# Altium project wulpus_acq_pcb.PrjPcb (part 2 of 2)

## Sheet 02_MSP430.SchDoc: Wearable Ultra Low-Power Ultrasound probe
size A3; DrawnBy: Sebastian Frey; Organization: Integrated Systems Laboratory; Revision: v1.2; SheetNumber: 3; SheetTotal: 6
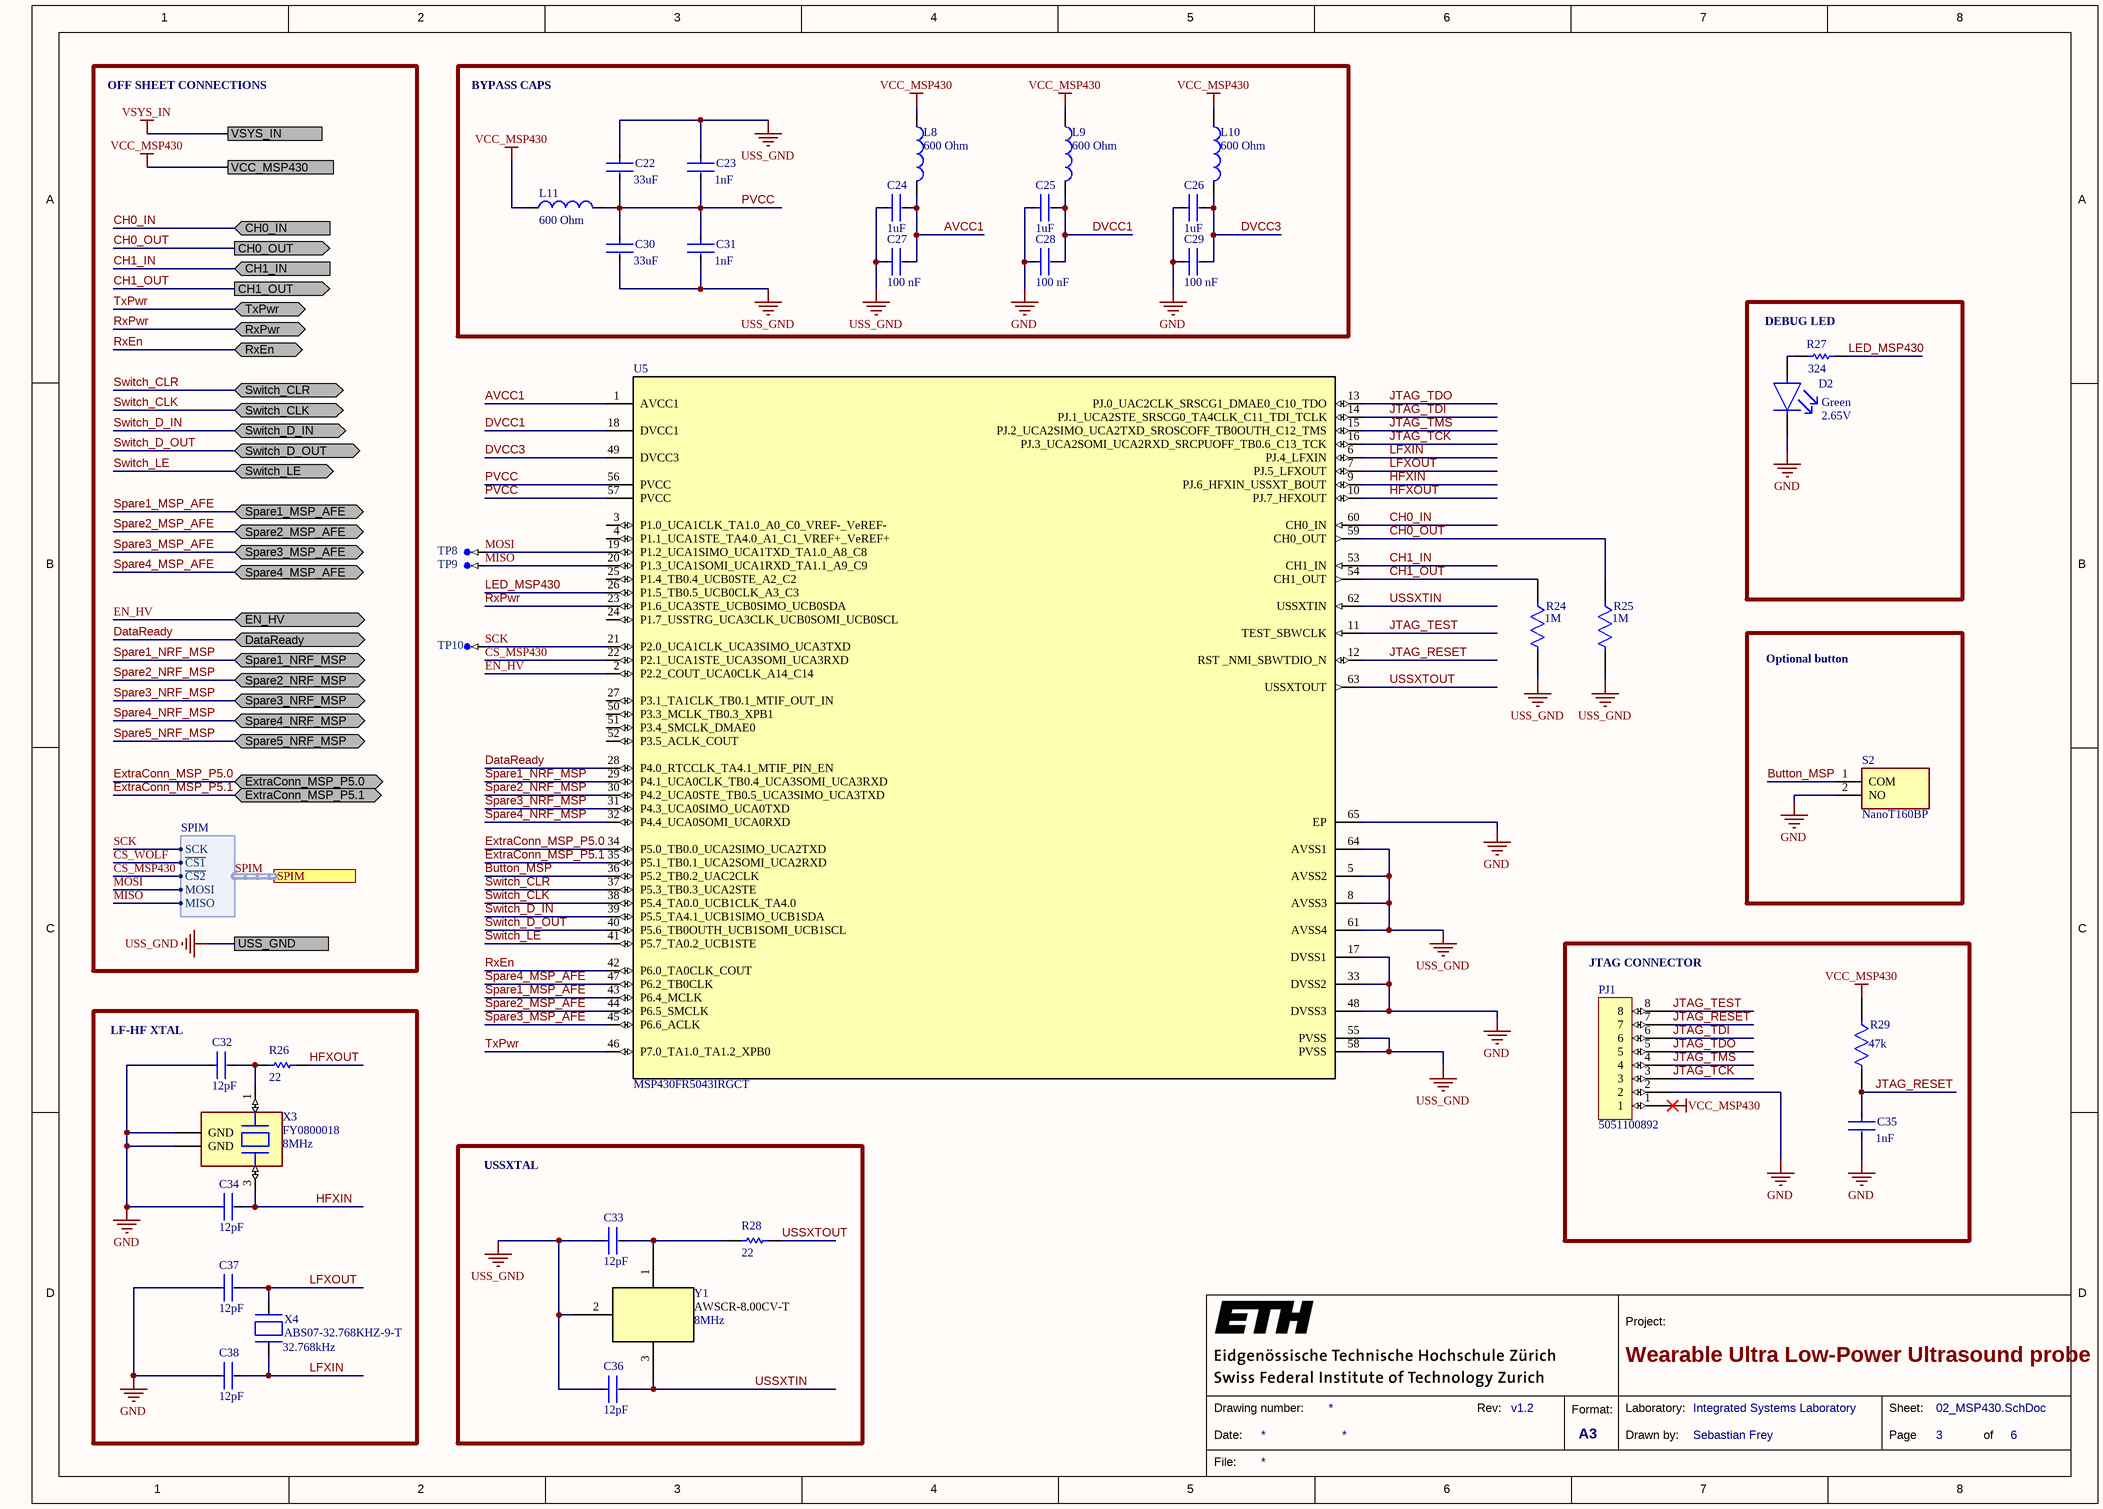
[diagram p2: 02_MSP430.SchDoc]

### Parts
C22  Capacitance: 33uF  [FP-C2012-125-0_2-IPC_A]  (hidden comment: C2012X5R1A336M125AC)
C23  Capacitance: 1nF  [FP-GRM155-0_05-IPC_B]  (hidden comment: GRM1555C1H102JA01D)
C24  Capacitance: 1uF  [FP-C1608-080-0_1-IPC_B]  (hidden comment: C1608X7R1C105K080AC)
C25  Capacitance: 1uF  [FP-C1608-080-0_1-IPC_B]  (hidden comment: C1608X7R1C105K080AC)
C26  Capacitance: 1uF  [FP-C1608-080-0_1-IPC_B]  (hidden comment: C1608X7R1C105K080AC)
C27  value 100 nF  [FP-CC0402-MFG]  (hidden comment: CC0402KRX7R7BB104)
C28  value 100 nF  [FP-CC0402-MFG]  (hidden comment: CC0402KRX7R7BB104)
C29  value 100 nF  [FP-CC0402-MFG]  (hidden comment: CC0402KRX7R7BB104)
C30  Capacitance: 33uF  [FP-C2012-125-0_2-IPC_A]  (hidden comment: C2012X5R1A336M125AC)
C31  Capacitance: 1nF  [FP-GRM155-0_05-IPC_B]  (hidden comment: GRM1555C1H102JA01D)
C32  Capacitance: 12pF  [FP-GJM155-0_05-IPC_A]  (hidden comment: GJM1555C1H120GB01D)
C33  Capacitance: 12pF  [FP-GJM155-0_05-IPC_A]  (hidden comment: GJM1555C1H120GB01D)
C34  Capacitance: 12pF  [FP-GJM155-0_05-IPC_A]  (hidden comment: GJM1555C1H120GB01D)
C35  Capacitance: 1nF  [FP-GRM155-0_05-IPC_B]  (hidden comment: GRM1555C1H102JA01D)
C36  Capacitance: 12pF  [FP-GJM155-0_05-IPC_A]  (hidden comment: GJM1555C1H120GB01D)
C37  Capacitance: 12pF  [FP-GJM155-0_05-IPC_A]  (hidden comment: GJM1555C1H120GB01D)
C38  Capacitance: 12pF  [FP-GJM155-0_05-IPC_A]  (hidden comment: GJM1555C1H120GB01D)
D2  Forward Voltage: 2.65V  Color: Green  [FP-APHD1608LZGCK-MFG]  (hidden comment: APHD1608LZGCK)
L8  Impedance: 600 Ohm  [SMD-0805]  (hidden comment: 742792040)
L9  Impedance: 600 Ohm  [SMD-0805]  (hidden comment: 742792040)
L10  Impedance: 600 Ohm  [SMD-0805]  (hidden comment: 742792040)
L11  Impedance: 600 Ohm  [SMD-0805]  (hidden comment: 742792040)
PJ1  5051100892  [MOLEX_5051100892]
R24  Resistance: 1M  [FP-CRCW0402-e3-MFG]  (hidden comment: CRCW04021M00FKED)
R25  Resistance: 1M  [FP-CRCW0402-e3-MFG]  (hidden comment: CRCW04021M00FKED)
R26  Resistance: 22  [RESC1005X40X25NL05T10]  (hidden comment: RC0402JR-0722RL)
R27  Resistance: 324  [RESC1005X35X20ML05T10]  (hidden comment: CPF0402B324RE1)
R28  Resistance: 22  [RESC1005X40X25NL05T10]  (hidden comment: RC0402JR-0722RL)
R29  Resistance: 47k  [FP-CRCW0402-e3-IPC_C]  (hidden comment: CRCW040247K0FKED)
S2  NanoT160BP  [NanoT160BP]
TP8  TP-SM-C-100  [TP-SM-C-100]  (value not drawn)  (no BOM)
TP9  TP-SM-C-100  [TP-SM-C-100]  (value not drawn)  (no BOM)
TP10  TP-SM-C-100  [TP-SM-C-100]  (value not drawn)  (no BOM)
U5  MSP430FR5043IRGCT  [RGC0064G]
X3  FY0800018  Frequency: 8MHz  [XTAL_ECS-80-18-30B-AGN-TR]
X4  ABS07-32.768KHZ-9-T  Frequency: 32.768kHz  [XTAL320X150X90]
Y1  Frequency: 8MHz  [AWSCR-8.00CV-T_ABR]  (hidden comment: AWSCR-8.00CV-T)

### Blocks framed on the sheet
BYPASS CAPS: C22-C31 L8-L11
DEBUG LED: D2 R27
Optional button: S2
JTAG CONNECTOR: C35 PJ1 R29
LF-HF XTAL: C32 C34 C37 C38 R26 X3 X4
USSXTAL: C33 C36 R28 Y1

### Ports
CH0_IN (in), CH0_OUT (out), CH1_IN (in), CH1_OUT (out), DataReady (bidir), EN_HV (bidir), ExtraConn_MSP_P5.0 (bidir), ExtraConn_MSP_P5.1 (bidir), RxEn (bidir), RxPwr (bidir), Spare1_MSP_AFE (bidir), Spare1_NRF_MSP (bidir), Spare2_MSP_AFE (bidir), Spare2_NRF_MSP (bidir), Spare3_MSP_AFE (bidir), Spare3_NRF_MSP (bidir), Spare4_MSP_AFE (bidir), Spare4_NRF_MSP (bidir), Spare5_NRF_MSP (bidir), SPIM (harness SPIM), Switch_CLK (bidir), Switch_CLR (bidir), Switch_D_IN (bidir), Switch_D_OUT (bidir), Switch_LE (bidir), TxPwr (bidir), USS_GND, VCC_MSP430, VSYS_IN

### Harnesses
SPIM: SCK, ~{CS1}, ~{CS2}, MOSI, MISO

### Nets
GND: C25.2 C26.2 C28.1 C29.1 C32.1 C34.1 C35.2 C37.1 C38.1 D2.1(C) PJ1.2 S2.2(NO) U5.17(DVSS1) U5.33(DVSS2) U5.48(DVSS3) U5.65(EP) X3.2(GND) X3.4(GND)
USS_GND: C22.1 C23.1 C24.2 C27.1 C30.2 C31.2 C33.1 C36.1 R24.2 R25.2 U5.5(AVSS2) U5.8(AVSS3) U5.55(PVSS) U5.58(PVSS) U5.61(AVSS4) U5.64(AVSS1) Y1.2 ; port USS_GND
VCC_MSP430: L8.1 L9.1 L10.1 L11.1 PJ1.1 R29.1 ; port VCC_MSP430
AVCC1: C24.1 C27.2 L8.2 U5.1(AVCC1)
Button_MSP: S2.1(COM) U5.36(P5.2_TB0.2_UAC2CLK)
CH0_IN: U5.60(CH0_IN) ; port CH0_IN
CH0_OUT: R25.1 U5.59(CH0_OUT) ; port CH0_OUT
CH1_IN: U5.53(CH1_IN) ; port CH1_IN
CH1_OUT: R24.1 U5.54(CH1_OUT) ; port CH1_OUT
CS_MSP430: U5.22(P2.1_UCA1STE_UCA3SOMI_UCA3RXD) ; port SPIM.~{CS2}
DataReady: U5.28(P4.0_RTCCLK_TA4.1_MTIF_PIN_EN) ; port DataReady
DVCC1: C25.1 C28.2 L9.2 U5.18(DVCC1)
DVCC3: C26.1 C29.2 L10.2 U5.49(DVCC3)
EN_HV: U5.2(P2.2_COUT_UCA0CLK_A14_C14) ; port EN_HV
ExtraConn_MSP_P5.0: U5.34(P5.0_TB0.0_UCA2SIMO_UCA2TXD) ; port ExtraConn_MSP_P5.0
ExtraConn_MSP_P5.1: U5.35(P5.1_TB0.1_UCA2SOMI_UCA2RXD) ; port ExtraConn_MSP_P5.1
HFXIN: C34.2 U5.9(PJ.6_HFXIN_USSXT_BOUT) X3.3(OUT/IN)
HFXOUT: R26.2 U5.10(PJ.7_HFXOUT)
JTAG_RESET: C35.1 PJ1.7 R29.2 U5.12(RST__NMI_SBWTDIO_N)
JTAG_TCK: PJ1.3 U5.16(PJ.3_UCA2SOMI_UCA2RXD_SRCPUOFF_TB0.6_C13_TCK)
JTAG_TDI: PJ1.6 U5.14(PJ.1_UCA2STE_SRSCG0_TA4CLK_C11_TDI_TCLK)
JTAG_TDO: PJ1.5 U5.13(PJ.0_UAC2CLK_SRSCG1_DMAE0_C10_TDO)
JTAG_TEST: PJ1.8 U5.11(TEST_SBWCLK)
JTAG_TMS: PJ1.4 U5.15(PJ.2_UCA2SIMO_UCA2TXD_SROSCOFF_TB0OUTH_C12_TMS)
LED_MSP430: R27.1 U5.26(P1.5_TB0.5_UCB0CLK_A3_C3)
LFXIN: C38.2 U5.6(PJ.4_LFXIN) X4.1
LFXOUT: C37.2 U5.7(PJ.5_LFXOUT) X4.2
MISO: TP9.1 U5.20(P1.3_UCA1SOMI_UCA1RXD_TA1.1_A9_C9) ; port SPIM.MISO
MOSI: TP8.1 U5.19(P1.2_UCA1SIMO_UCA1TXD_TA1.0_A8_C8) ; port SPIM.MOSI
PVCC: C22.2 C23.2 C30.1 C31.1 L11.2 U5.56(PVCC) U5.57(PVCC)
RxEn: U5.42(P6.0_TA0CLK_COUT) ; port RxEn
RxPwr: U5.23(P1.6_UCA3STE_UCB0SIMO_UCB0SDA) ; port RxPwr
SCK: TP10.1 U5.21(P2.0_UCA1CLK_UCA3SIMO_UCA3TXD) ; port SPIM.SCK
Spare1_MSP_AFE: U5.43(P6.4_MCLK) ; port Spare1_MSP_AFE
Spare1_NRF_MSP: U5.29(P4.1_UCA0CLK_TB0.4_UCA3SOMI_UCA3RXD) ; port Spare1_NRF_MSP
Spare2_MSP_AFE: U5.44(P6.5_SMCLK) ; port Spare2_MSP_AFE
Spare2_NRF_MSP: U5.30(P4.2_UCA0STE_TB0.5_UCA3SIMO_UCA3TXD) ; port Spare2_NRF_MSP
Spare3_MSP_AFE: U5.45(P6.6_ACLK) ; port Spare3_MSP_AFE
Spare3_NRF_MSP: U5.31(P4.3_UCA0SIMO_UCA0TXD) ; port Spare3_NRF_MSP
Spare4_MSP_AFE: U5.47(P6.2_TB0CLK) ; port Spare4_MSP_AFE
Spare4_NRF_MSP: U5.32(P4.4_UCA0SOMI_UCA0RXD) ; port Spare4_NRF_MSP
Spare5_NRF_MSP: port Spare5_NRF_MSP
Switch_CLK: U5.38(P5.4_TA0.0_UCB1CLK_TA4.0) ; port Switch_CLK
Switch_CLR: U5.37(P5.3_TB0.3_UCA2STE) ; port Switch_CLR
Switch_D_IN: U5.39(P5.5_TA4.1_UCB1SIMO_UCB1SDA) ; port Switch_D_IN
Switch_D_OUT: U5.40(P5.6_TB0OUTH_UCB1SOMI_UCB1SCL) ; port Switch_D_OUT
Switch_LE: U5.41(P5.7_TA0.2_UCB1STE) ; port Switch_LE
TxPwr: U5.46(P7.0_TA1.0_TA1.2_XPB0) ; port TxPwr
USSXTIN: C36.2 U5.62(USSXTIN) Y1.3
USSXTOUT: R28.2 U5.63(USSXTOUT)
NetC32_2: C32.2 R26.1 X3.1(IN/OUT)
NetC33_2: C33.2 R28.1 Y1.1
NetD2_2: D2.2(A) R27.2

Not connected (* = marked no-connect by the designer): U5 3(P1.0_UCA1CLK_TA1.0_A0_C0_VREF-_VeREF-) 4(P1.1_UCA1STE_TA4.0_A1_C1_VREF+_VeREF+) 24(P1.7_USSTRG_UCA3CLK_UCB0SOMI_UCB0SCL) 25(P1.4_TB0.4_UCB0STE_A2_C2) 27(P3.1_TA1CLK_TB0.1_MTIF_OUT_IN) 50(P3.3_MCLK_TB0.3_XPB1) 51(P3.4_SMCLK_DMAE0) 52(P3.5_ACLK_COUT)

### Buses and harness runs
harness SPIM = port SPIM

### Notes on the sheet
- OFF SHEET CONNECTIONS
- 1
- 2
- 3
- 4
- 5
- 6
- 7
- 8
- A
- B
- C
- D
- Project:
- Date:
- Drawing number:
- Rev:
- Format:
- A3
- Drawn by:
- Laboratory:
- Page
- Sheet:
- of
- File:

### Library data of the parts
C22 C30 = CMP-08246-002720-1: Multilayer Ceramic Capacitors 33μF ±20% 10V X5R SMD 0805; Dielectric: X5R; Series: C; Packaging: Tape and Reel; Voltage Rating: 10V; Height: 1.25mm; Tolerance: 20%; Thickness: 0.057inch; Min Operating Temperature: -55°C; Max Operating Temperature: 85°C; Case Code (Imperial): 0805; Voltage Rating (DC): 10V; Case Code (Metric): 2012; Length: 2mm; REACH SVHC: No SVHC; Depth: 1.25mm; Package Quantity: 1; Dielectric Material: Ceramic; Lead Free: Lead Free; Case/Package: 0805; Termination: SMD/SMT; Resistor Type: Ceramic; RoHS Compliant: Yes; Width: 0.049inch; Weight: 0.000194oz; Mount: Surface Mount
C23 C31 C35 = CMP-2008-04254-2: Chip Multilayer Ceramic Capacitors for General Purpose, 0402, 1000pF, C0G, 30ppm/°C, 5%, 50V; Insulation Resistance: 10GR; Packaging: Tape and Reel; Lead Free: Lead Free; Tolerance: 5%; Temperature Coefficient: 30ppm/°C; Thickness: 0.022inch; Termination: SMD/SMT; Max Operating Temperature: 125°C; Height: 0.5mm; Package Quantity: 1; Radiation Hardening: No; Material: Ceramic; Case Code (Metric): 1005; Number of Pins: 2; Voltage Rating: 50V; Mount: Surface Mount; Voltage: 50V; Case/Package: 0402; Min Operating Temperature: -55°C; Dielectric Material: Ceramic; Width: 0.5mm; Depth: 0.5mm; Case Code (Imperial): 0402; REACH SVHC: No SVHC; Dielectric: C0G; Voltage Rating (DC): 50V; Length: 1mm
C24-C26 = CMP-08246-002727-1: Multilayer Ceramic Capacitors 1μF ±10% 16V X7R SMD 0603; Mount: Surface Mount; Width: 0.031inch; Radiation Hardening: No; Dielectric Material: Ceramic; Packaging: Tape and Reel; Voltage Rating: 16V; Weight: 7.1E-05oz; Termination: SMD/SMT; Package Quantity: 1; Voltage Rating (DC): 16V; REACH SVHC: No SVHC; Voltage: 16V; Min Operating Temperature: -55°C; Depth: 0.8mm; Height: 0.8mm; Length: 1.6mm; Case Code (Metric): 1608; Thickness: 0.037inch; Lead Free: Lead Free; Resistor Type: Ceramic; RoHS Compliant: Yes; Series: C; Construction: Flat; Max Operating Temperature: 125°C; Tolerance: 10%; Case/Package: 0603; Dielectric: X7R; Case Code (Imperial): 0603
C27-C29 = CMP-03422-000048-1: CAP CER 0.1UF 16V X7R 0402; Manufacturer: YAGEO; Material: Ceramic; Automotive Grade: NA; Temperature Coefficient: 30ppm/°C; Tolerance: 0.1; Device Class L1: Passive Components; Temperature Range Low: -55°C; Device Class L3: Ceramic Capacitors; Temperature Characteristic: X7R; Ipc Land Pattern Name: CAPC10050X50; Capacitance: 100 nF; Temperature Range High: +125°C; Voltage Rating: 16 V; Temperature: -55°C to +125°C; RoHS: TRUE; Automotive: No; Height: 0.55mm; Device Class L2: Capacitors; Digikey Description: CAP CER 0.1UF 16V X7R 0402; Package: CC0402; Footprint Url: http://www.yageo.com/exep/pages/download/literatures/UPY-C_GEN_24.pdf; ComponentLink2Description: Datasheet; Category: Cap; Lead Free: Yes; Octopart: https://octopart.com/cc0402krx7r7bb104-yageo-42244624; ComponentLink2URL: http://www.yageo.com/documents/recent/UPY-GP_NP0_16V-to-50V_16.pdf; Manufacturer Part Number: CC0402KRX7R7BB104; Mouser Description: 0402 0.1 uF 16 V ±10 % Tolerance X7R SMT Multilayer Ceramic Capacitor
C32-C34 C36-C38 = CMP-2008-03799-2: Multi-Layer Ceramic Capacitor 12pF C0G  ±2% 0402 Paper T/R; Voltage Rating: 50V; Tolerance: 2%; Length: 1mm; Width: 0.5mm; Thickness: 0.022inch; Package Quantity: 10000; Lead Free: Lead Free; Mount: Surface Mount; Voltage Rating (DC): 50V; Max Operating Temperature: 125°C; Termination: SMD/SMT; Depth: 0.5mm; Min Operating Temperature: -55°C; Height: 0.5mm; Case Code (Imperial): 0402; Case/Package: 0402; Case Code (Metric): 1005; Dielectric: C0G; Packaging: Tape and Reel; Radiation Hardening: No
D2 = CMP-44529-000045-1: LED GREEN CLEAR 1608 SMD; Test Current: 2mA; Dominant Wavelength: 525nm; Lens Color: Colorless; Luminous Intensity: 180mcd; Viewing Angle: 100°; Lens Size: 0.7mm; Lens Style: Round; Mount: Surface Mount; Packaging: Tape and Reel; Lens Transparency: Clear; Height: 0.75mm; Case/Package: 0603; Length: 1.6mm; Case Code (Metric): 1608; Width: 0.8mm; Case Code (Imperial): 0603
L8-L11 = CMP-0220-00032-1: SMD EMI Suppression Ferrite Bead WE-CBF, Z = 600 Ohm; PackageVersion: 2005; ComponentLink2Description: Datasheet; PackageDescription: Chip Inductor, 2-Leads, Body 2.0 x 1.2 mm; ComponentLink1URL: http://www.we-online.com; PackageReference: SMD-0805; DatasheetVersion: Dec-2005; ComponentLink2URL: http://www.we-online.de/katalog/media/pdf/742792040.pdf; ComponentLink1Description: Manufacturer Link
PJ1 = MOLEX_5051100892
R24 R25 = CMP-2002-08314-2: RES Thick Film, 1MΩ, 1%, 0.063W, 100ppm/°C, 0402; Power Rating: 63mW; Voltage Rating (DC): 50V; Min Operating Temperature: -55°C; Lead Free: Lead Free; Case Code (Imperial): 0402; Packaging: Tape and Reel; Case Code (Metric): 1005; Tolerance: 1%; Number of Terminations: 2; Features: Automotive AEC-Q200; Number of Pins: 2; Max Power Dissipation: 63mW; Height: 0.35mm; Weight: 2.3E-05oz; Package Quantity: 10; Contact Plating: Tin; Temperature Coefficient: 100ppm/°C; Radiation Hardening: No; Length: 1mm; Termination: SMD/SMT; Depth: 0.5mm; Case/Package: 0402; Voltage Rating: 50V; Composition: Thick Film; Width: 0.02inch; Max Operating Temperature: 155°C; Military Standard: Not
R26 R28 = CMP-2002-07961-1: Manufacturer: Yageo / Phycomp; Part Number: RC0402JR-0722RL
R27 = CMP-2002-03257-1: Manufacturer: TE Connectivity / AMP; Part Number: CPF0402B324RE1
R29 = CMP-02407-007705-1: RES Thick Film, 47kΩ, 1%, 0.063W, 100ppm/°C, 0402; Voltage Rating (DC): 50V; Power Rating: 63mW; Temperature Coefficient: 100ppm/°C; Mount: Surface Mount; Radiation Hardening: No; Case Code (Imperial): 0402; Case Code (Metric): 1005; Contact Plating: Tin; Case/Package: 0402; Package Quantity: 10000; Width: 0.5mm; Lead Free: Lead Free; Packaging: Tape and Reel; Length: 1mm; Max Operating Temperature: 155°C; Min Operating Temperature: -55°C; Tolerance: 1%; Weight: 2.3E-05oz; Working Voltage: 50V; Voltage Rating: 50V; Height: 0.35mm; Depth: 0.5mm; Composition: Thick Film; Number of Terminations: 2; Termination: SMD/SMT; Military Standard: Not
S2 = NanoT160BP: Switch; Manufacturer_Name: LITTELFUSE; Datasheet Link: https://www.ckswitches.com/media/2866/nanot.pdf; Height: 1mm; Manufacturer_Part_Number: NanoT160BP
TP8-TP10 = CMP-0484-00002-1: Test Point, Surface Mount, Circular, Pad Diameter 1 mm
U5 = MSP430FR5043IRGCT: No Description Available; Mfr_Name: Texas Instruments; Type: DEV; RefDes: RefDes; Copyright: Copyright (C) 2021 Ultra Librarian. All rights reserved.; Manufacturer_Part_Number: MSP430FR5043IRGCT
X3 = FY0800018: Crystal 8MHz ±30ppm (Tol) ±30ppm (Stability) 18pF FUND 100Ohm 4-Pin SMD T/R; Manufacturer: Diodes; ESR (Equivalent Series Resistance): 100R; Supplier 1: Digi-Key; Manufacturer Part Number: FY0800018; RoHS: Yes; Category: Crystals; Stock 1: 10869; Pricing 1: 1=0.80000, 10=0.70800, 50=0.66220, 100=0.58520, 500=0.55440 (USD); Mount: Surface Mount; Case/Package: SMD/SMT; Min Operating Temperature: -40°C; Max Operating Temperature: 85°C; Packaging: Cut Tape; Frequency Stability: 30ppm; Frequency Tolerance: 30ppm; Load Capacitance: 18pF; Length: 0.197inch; Width: 0.126inch; Height: 0.043inch; ComponentLink1URL: http://media.digikey.com/pdf/Data%20Sheets/Pericom%20PDFs/FY0800018_VerB.pdf?src-supplier=Digi-Key; ComponentLink1Description: http://media.digikey.com/pdf/Data%20Sheets/Pericom%20PDFs/FY0800018_VerB.pdf?src-supplier=Digi-Key; Supplier Part Number 1: FY0800018CT-ND
X4 = ABS07-32.768KHZ-9-T: Crystal; Miniature; 3.2 x 1.5 x 0.9mm; 32.768KHZ; 9pf; 20ppm -40+85C; SMD; T/R; Manufacturer: Abracon; ESR (Equivalent Series Resistance): 70kR; Insulation Resistance: 500MR; Supplier 1: Digi-Key; Manufacturer Part Number: ABS07-32.768KHZ-9-T; RoHS: Yes; Category: Crystals; Stock 1: 83876; Pricing 1: 1=1.36000, 10=1.30000, 50=1.27000, 100=1.08860, 500=1.05840, 1000=0.89208 (USD); Mount: Surface Mount; Case/Package: CSMD; Number of Pins: 2; Min Operating Temperature: -40°C; Max Operating Temperature: 85°C; Load Capacitance: 9pF; Packaging: Tape and Reel; Frequency Tolerance: 20ppm; Package Quantity: 3000; Tolerance: 20ppm; Frequency Stability: 20ppm; Termination: SMD/SMT; Series Resistance: 70kR; Series: ABS07; Operating Frequency: 32.768 kHz; Length: 3.2mm; Width: 1.5mm; Height: 0.035inch; Depth: 1.5mm; Radiation Hardening: No; RoHS Compliant: Yes; REACH SVHC: No SVHC; Lead Free: Lead Free; ComponentLink1URL: https://datasheet.ciiva.com/855/abs07-855948.pdf?src-supplier=Digi-Key; ComponentLink1Description: https://datasheet.ciiva.com/855/abs07-855948.pdf?src-supplier=Digi-Key; Supplier Part Number 1: 535-9544-1-ND
Y1 = AWSCR-8.00CV-T: No Description Available; Mfr_Name: Abracon; Copyright: Copyright (C) 2021 Ultra Librarian. All rights reserved.; RefDes: RefDes; Type: DEV; Manufacturer_Part_Number: AWSCR-8.00CV-T

## Sheet 03_MSP430_AFE.SchDoc: Wearable Ultra Low-Power Ultrasound probe
size A3; DrawnBy: Sebastian Frey; Organization: Integrated Systems Laboratory; Revision: v1.2; SheetNumber: 4; SheetTotal: 6
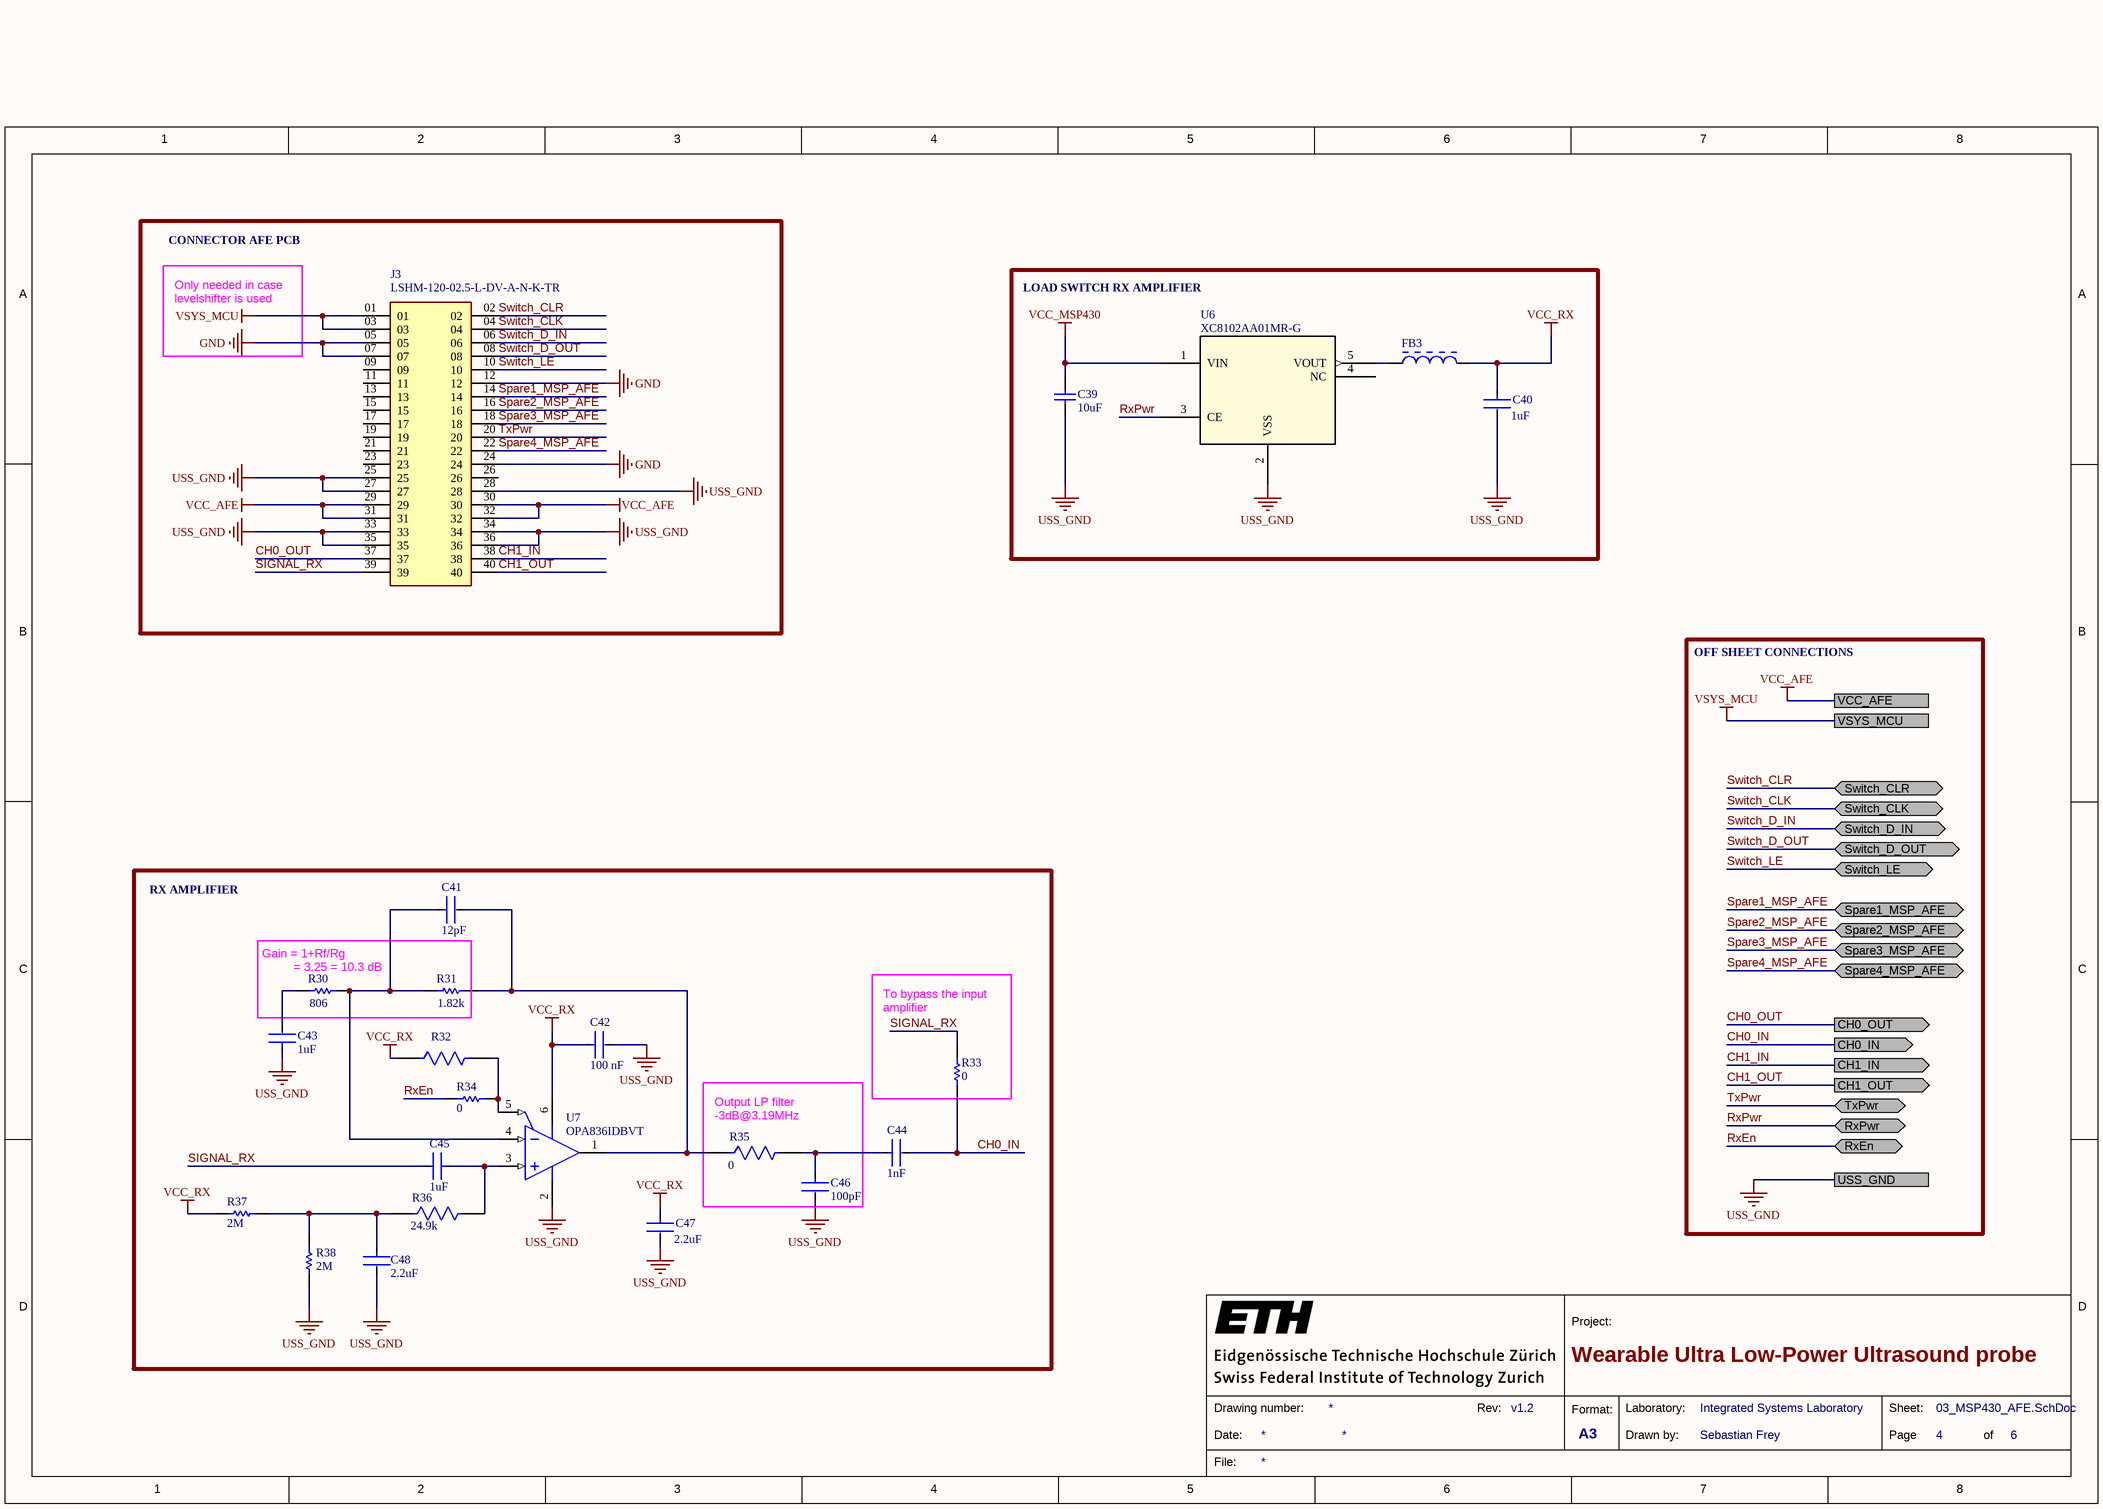
[diagram p3: 03_MSP430_AFE.SchDoc]

### Parts
C39  value 10uF  [CAPC0603(1608)100_L]  (hidden comment: C1608X5R1A106K080AC)
C40  Capacitance: 1uF  [FP-C1608-080-0_1-IPC_B]  (hidden comment: C1608X7R1C105K080AC)
C41  Capacitance: 12pF  [FP-GJM155-0_05-IPC_A]  (hidden comment: GJM1555C1H120GB01D)
C42  value 100 nF  [FP-CC0402-MFG]  (hidden comment: CC0402KRX7R7BB104)
C43  Capacitance: 1uF  [FP-C1608-080-0_1-IPC_B]  (hidden comment: C1608X7R1C105K080AC)
C44  Capacitance: 1nF  [FP-GRM155-0_05-IPC_B]  (hidden comment: GRM1555C1H102JA01D)
C45  Capacitance: 1uF  [FP-C1608-080-0_1-IPC_B]  (hidden comment: C1608X7R1C105K080AC)
C46  Capacitance: 100pF  [FP-04025A101JAT2A-MFG]  (hidden comment: 04025A101JAT2A)
C47  Capacitance: 2.2uF  [FP-CGA3E-0_3-0_1-MFG]  (hidden comment: GRM188R61C225KE15D)
C48  Capacitance: 2.2uF  [FP-CGA3E-0_3-0_1-MFG]  (hidden comment: GRM188R61C225KE15D)
FB3  BLM03AX800SN1D  [MURA-BLM03-CHIP-2_V]  (value not drawn)
J3  LSHM-120-02.5-L-DV-A-N-K-TR  [SAMTEC_LSHM-120-XX.X-X-DV-A-N-XX]
R30  Resistance: 806  [RESC1608X55X25LL10T15]  (hidden comment: RC0603FR-07806RL)
R31  Resistance: 1.82k  [RESC1608X55X25ML10T15]  (hidden comment: RC0603FR-071K82L)
R32  TNPW040210K0BEED  [FP-TNPW0402-e3-MFG]  (value not drawn)
R33  Resistance: 0  [RESC1005X40X25NL05T10]  (hidden comment: RC0402JR-070RL)
R34  Resistance: 0  [RESC1005X40X25NL05T10]  (hidden comment: RC0402JR-070RL)
R35  Resistance: 0  [FP-CR0402-IPC_B]  (hidden comment: CR0402-J/-000GLF)
R36  Resistance: 24.9k  [FP-RC_L0603-MFG]  (hidden comment: RC0603FR-0724K9L)
R37  Parameter 1: 2M  [RESC1608X55X30LL15T15]  (hidden comment: RC0603FR-072ML)
R38  Parameter 1: 2M  [RESC1608X55X30LL15T15]  (hidden comment: RC0603FR-072ML)
U6  XC8102AA01MR-G  [XC8102_SOT-25_TOR]
U7  OPA836IDBVT  [DBV0006A_L]

### Blocks framed on the sheet
CONNECTOR AFE PCB: J3
LOAD SWITCH RX AMPLIFIER: C39 C40 FB3 U6
RX AMPLIFIER: C41-C48 R30-R38 U7

### Ports
CH0_IN (out), CH0_OUT (out), CH1_IN (out), CH1_OUT (out), RxEn (bidir), RxPwr (bidir), Spare1_MSP_AFE (bidir), Spare2_MSP_AFE (bidir), Spare3_MSP_AFE (bidir), Spare4_MSP_AFE (bidir), Switch_CLK (bidir), Switch_CLR (bidir), Switch_D_IN (bidir), Switch_D_OUT (bidir), Switch_LE (bidir), TxPwr (bidir), USS_GND, VCC_AFE, VSYS_MCU

### Nets
GND: J3.05 J3.07 J3.12 J3.24
USS_GND: C39.1 C40.1 C42.2 C43.2 C46.1 C47.2 C48.2 J3.25 J3.27 J3.28 J3.33 J3.34 J3.35 J3.36 R38.1 U6.2(VSS) U7.2(VS-) ; port USS_GND
VCC_AFE: J3.29 J3.30 J3.31 J3.32 ; port VCC_AFE
VCC_MSP430: C39.2 U6.1(VIN)
VCC_RX: C40.2 C42.1 C47.1 FB3.2 R32.1 R37.2 U7.6(VS+)
VSYS_MCU: J3.01 J3.03 ; port VSYS_MCU
CH0_IN: C44.2 R33.1 ; port CH0_IN
CH0_OUT: J3.37 ; port CH0_OUT
CH1_IN: J3.38 ; port CH1_IN
CH1_OUT: J3.40 ; port CH1_OUT
RxEn: R34.2 ; port RxEn
RxPwr: U6.3(CE) ; port RxPwr
SIGNAL_RX: C45.1 J3.39 R33.2
Spare1_MSP_AFE: J3.14 ; port Spare1_MSP_AFE
Spare2_MSP_AFE: J3.16 ; port Spare2_MSP_AFE
Spare3_MSP_AFE: J3.18 ; port Spare3_MSP_AFE
Spare4_MSP_AFE: J3.22 ; port Spare4_MSP_AFE
Switch_CLK: J3.04 ; port Switch_CLK
Switch_CLR: J3.02 ; port Switch_CLR
Switch_D_IN: J3.06 ; port Switch_D_IN
Switch_D_OUT: J3.08 ; port Switch_D_OUT
Switch_LE: J3.10 ; port Switch_LE
TxPwr: J3.20 ; port TxPwr
NetC41_1: C41.1 R30.2 R31.1 U7.4(VIN-)
NetC41_2: C41.2 R31.2 R35.1 U7.1(VOUT)
NetC43_1: C43.1 R30.1
NetC44_1: C44.1 C46.2 R35.2
NetC45_2: C45.2 R36.2 U7.3(VIN+)
NetC48_1: C48.1 R36.1 R37.1 R38.2
NetFB3_1: FB3.1 U6.5(VOUT)
NetR32_2: R32.2 R34.1 U7.5(~{PD})

Not connected (* = marked no-connect by the designer): J3 09 11 13 15 17 19 21 23 26; U6 4(NC)

### Notes on the sheet
- Only needed in case levelshifter is used
- OFF SHEET CONNECTIONS
- (near R30) Gain = 1+Rf/Rg
  = 3.25 = 10.3 dB
- (near R33) To bypass the input amplifier
- (near R35) Output LP filter
  -3dB@3.19MHz
- 1
- 2
- 3
- 4
- 5
- 6
- 7
- 8
- A
- B
- C
- D
- Project:
- Date:
- Drawing number:
- Rev:
- Format:
- A3
- Drawn by:
- Laboratory:
- Page
- Sheet:
- of
- File:

### Library data of the parts
C39 = CMP-1035-02799-1: CAP 10uF 10V ±10% 0603 (1608 Metric) Thickness 1mm SMD; Tolerance: Â±10%; Case-Metric: 1608; Case-EIA: 0603; Max Thickness: 1 mm; Technology: SMT; Rated Voltage: 10 V
C40 C43 C45 = CMP-08246-002727-1: as C24 on sheet 02_MSP430; Mount: Surface Mount; Width: 0.031inch; Radiation Hardening: No; Dielectric Material: Ceramic; Packaging: Tape and Reel; Voltage Rating: 16V; Weight: 7.1E-05oz; Termination: SMD/SMT; Package Quantity: 1; Voltage Rating (DC): 16V; REACH SVHC: No SVHC; Voltage: 16V; Min Operating Temperature: -55°C; Depth: 0.8mm; Height: 0.8mm; Length: 1.6mm; Case Code (Metric): 1608; Thickness: 0.037inch; Lead Free: Lead Free; Resistor Type: Ceramic; RoHS Compliant: Yes; Series: C; Construction: Flat; Max Operating Temperature: 125°C; Tolerance: 10%; Case/Package: 0603; Dielectric: X7R; Case Code (Imperial): 0603
C41 = CMP-2008-03799-2: as C32 on sheet 02_MSP430; Tolerance: 2%; Length: 1mm; Width: 0.5mm; Thickness: 0.022inch; Package Quantity: 10000; Lead Free: Lead Free; Mount: Surface Mount; Voltage Rating (DC): 50V; Max Operating Temperature: 125°C; Termination: SMD/SMT; Depth: 0.5mm; Min Operating Temperature: -55°C; Height: 0.5mm; Case Code (Imperial): 0402; Case/Package: 0402; Case Code (Metric): 1005; Dielectric: C0G; Packaging: Tape and Reel; Radiation Hardening: No
C42 = CMP-03422-000048-1: as C27 on sheet 02_MSP430; Device Class L1: Passive Components; Temperature Range Low: -55°C; Device Class L3: Ceramic Capacitors; Temperature Characteristic: X7R; Ipc Land Pattern Name: CAPC10050X50; Capacitance: 100 nF; Temperature Range High: +125°C; Voltage Rating: 16 V; Temperature: -55°C to +125°C; RoHS: TRUE; Automotive: No; Height: 0.55mm; Device Class L2: Capacitors; Digikey Description: CAP CER 0.1UF 16V X7R 0402; Package: CC0402; Footprint Url: http://www.yageo.com/exep/pages/download/literatures/UPY-C_GEN_24.pdf; ComponentLink2Description: Datasheet; Category: Cap; Lead Free: Yes; Octopart: https://octopart.com/cc0402krx7r7bb104-yageo-42244624; ComponentLink2URL: http://www.yageo.com/documents/recent/UPY-GP_NP0_16V-to-50V_16.pdf; Manufacturer Part Number: CC0402KRX7R7BB104; Mouser Description: 0402 0.1 uF 16 V ±10 % Tolerance X7R SMT Multilayer Ceramic Capacitor
C44 = CMP-2008-04254-2: as C23 on sheet 02_MSP430; Packaging: Tape and Reel; Lead Free: Lead Free; Tolerance: 5%; Temperature Coefficient: 30ppm/°C; Thickness: 0.022inch; Termination: SMD/SMT; Max Operating Temperature: 125°C; Height: 0.5mm; Package Quantity: 1; Radiation Hardening: No; Material: Ceramic; Case Code (Metric): 1005; Number of Pins: 2; Voltage Rating: 50V; Mount: Surface Mount; Voltage: 50V; Case/Package: 0402; Min Operating Temperature: -55°C; Dielectric Material: Ceramic; Width: 0.5mm; Depth: 0.5mm; Case Code (Imperial): 0402; REACH SVHC: No SVHC; Dielectric: C0G; Voltage Rating (DC): 50V; Length: 1mm
C46 = CMP-2008-02568-2: CAP CER 100PF 50V C0G/NP0 0402; Tolerance: 5%; Insulation Resistance: 1GR; Dielectric: C0G; Dissipation Factor: 2.5%; Temperature Coefficient: 30ppm/°C; Depth: 0.5mm; Max Operating Temperature: 125°C; Voltage: 50V; Contact Plating: Tin; Width: 0.02inch; Radiation Hardening: No; Case/Package: 0402; Voltage Rating: 50V; Packaging: Tape and Reel; Termination: SMD/SMT; REACH SVHC: No SVHC; Case Code (Metric): 1005; Mount: Surface Mount; Package Quantity: 1; Height: 0.56mm; Construction: Flat; Case Code (Imperial): 0402; RoHS Compliant: Yes; Voltage Rating (DC): 50V; Thickness: 0.022inch; Series: -; Min Operating Temperature: -55°C; Lead Free: Lead Free; Length: 1mm
C47 C48 = CMP-08246-002299-1: Cap Ceramic 2.2uF 16V X5R 10% Pad SMD 0603 +85°C Automotive T/R; Max Operating Temperature: 85°C; Thickness: 0.035inch; Composition: Ceramic; Height: 0.8mm; Radiation Hardening: No; Tolerance: 10%; Package Quantity: 1; Case/Package: 0603; Case Code (Imperial): 0603; Termination: SMD/SMT; Depth: 0.8mm; Width: 0.031inch; Case Code (Metric): 1608; Dielectric: X5R; Voltage Rating (DC): 16V; Voltage Rating: 16V; Ratings: AEC-Q200; REACH SVHC: No SVHC; Mount: Surface Mount; Packaging: Tape and Reel; Min Operating Temperature: -55°C; Length: 1.6mm; Weight: 7.1E-05oz
FB3 = CMP-0686-00058-2: Chip Ferrite Bead for Power lines and Signal Lines, 80 Ohm, 500 mA, -55 to 125 degC, 0.6 x 0.3 x 0.33 mm SMD, Tape and Reel; Manufacturer: Murata; DC Resistance: 0.18 Ohm Max.; Rated Current: 500 mA; Impedance (at 100 MHz): 80 Ohm +/- 25%; Material: Steel; Impedance: 80R; Current Rating: 500mA; DC Resistance (DCR): 180mR; Test Frequency: 100MHz; Tolerance: 25%; Number of Lines: 1; PackageReference: BLM03-2; ComponentLink2URL: http://www.murata.com/products/catalog/pdf/c31e.pdf; ComponentLink2Description: Datasheet; ComponentLink1Description: Manufacturer URL; DatasheetVersion: 08/2013; ComponentLink1URL: http://www.murata.com/; ComponentLink3Description: Package Specification; ComponentLink3URL: http://www.murata.com/products/catalog/pdf/c31e.pdf; PackageDescription: 2-Pin Chip, Body 0.6 x 0.3 mm; Packing: Tape and Reel; Operating Temperature Range: -55 to 125 degC; Mounting Technology: Surface Mount; PartNumber: BLM03AX800SN1D; Supplier 1: Digi-Key; Supplier Part Number 1: 490-5621-1-ND; Manufacturer Part Number: BLM03AX800SN1D; RoHS: Yes; Category: Inductors; Stock 1: 13310; Pricing 1: 1=0.19000, 10=0.15200, 25=0.11840, 50=0.09820, 100=0.08470, 250=0.06776, 500=0.06098, 1000=0.05082, 5000=0.04743 (USD); Case/Package: 0201; Number of Pins: 2; Case Code (Metric): 0603; Case Code (Imperial): 0201; Min Operating Temperature: -55°C; Max Operating Temperature: 125°C; Package Quantity: 1; Packaging: Tape and Reel; Max DC Current: 500mA; Termination: SMD/SMT; Max Current Rating: 500mA; Number of Circuits: 1; Length: 0.6mm; Height: 0.3mm; Width: 0.3mm; REACH SVHC: No SVHC; ComponentLink4URL: https://datasheet.ciiva.com/1013/l0110s0100blm03ax-1013986.pdf?src-supplier=Digi-Key; ComponentLink4Description: https://datasheet.ciiva.com/1013/l0110s0100blm03ax-1013986.pdf?src-supplier=Digi-Key; ComponentLink5URL: https://datasheet.ciiva.com/41449/001172131-da-01-en-drossel-0201-80r-0-6x0-3mm-15000st-41449422.pdf?src-supplier=Conrad; ComponentLink5Description: https://datasheet.ciiva.com/41449/001172131-da-01-en-drossel-0201-80r-0-6x0-3mm-15000st-41449422.pdf?src-supplier=Conrad; ComponentLink6URL: https://datasheet.ciiva.com/1013/l0110e-1013987.pdf?src-supplier=Digi-Key; ComponentLink6Description: https://datasheet.ciiva.com/1013/l0110e-1013987.pdf?src-supplier=Digi-Key; ComponentLink7URL: https://datasheet.ciiva.com/1013/l0110e-1013988.pdf?src-supplier=Digi-Key; ComponentLink7Description: https://datasheet.ciiva.com/1013/l0110e-1013988.pdf?src-supplier=Digi-Key; ComponentLink8URL: https://datasheet.ciiva.com/46423/1851884-46423882.pdf?src-supplier=Element14; ComponentLink8Description: https://datasheet.ciiva.com/46423/1851884-46423882.pdf?src-supplier=Element14
J3 = LSHM-120-02.5-L-DV-A-N-K-TR: Conn Socket and Terminal Strip HDR/SKT 40 POS 0.5mm Solder ST SMD T/R; Manufacturer: Samtec; Number of Contacts: 40; Supplier 1: Digi-Key; RoHS: Yes; Category: Connectors; Stock 1: 3008; Pricing 1: 1=6.60000, 10=5.97000, 25=5.63960, 50=5.50200, 100=5.22690, 250=4.67672 (USD); Contact Plating: Gold; Contact Material: Bronze; Housing Color: Black; Housing Material: Polymer; Min Operating Temperature: -55°C; Max Operating Temperature: 125°C; Number of Rows: 2; Termination: Solder; Packaging: Tape and Reel; Orientation: Straight; Series: LSH; Length: 14.7mm; Pitch: 0.5mm; Depth: 4.98mm; Radiation Hardening: No; REACH SVHC: No SVHC; RoHS Compliant: Yes; ComponentLink1URL: http://www.farnell.com/datasheets/2372721.pdf?src-supplier=Farnell; ComponentLink1Description: http://www.farnell.com/datasheets/2372721.pdf?src-supplier=Farnell; ComponentLink2URL: http://www.farnell.com/datasheets/2000266.pdf?src-supplier=Farnell; ComponentLink2Description: http://www.farnell.com/datasheets/2000266.pdf?src-supplier=Farnell; ComponentLink3URL: http://components.arrow.com/part/dataview/0323_01943898?src-supplier=Arrow+Europe; ComponentLink3Description: http://components.arrow.com/part/dataview/0323_01943898?src-supplier=Arrow+Europe; ComponentLink4URL: http://components.arrow.com/part/dataview/48680868S8397842N1004?src-supplier=Arrow+Electronics; ComponentLink4Description: http://components.arrow.com/part/dataview/48680868S8397842N1004?src-supplier=Arrow+Electronics; ComponentLink5URL: http://www.farnell.com/datasheets/2000266.pdf?src-supplier=Element14; ComponentLink5Description: http://www.farnell.com/datasheets/2000266.pdf?src-supplier=Element14; ComponentLink6URL: http://suddendocs.samtec.com/prints/lshm-1xx-xx.x-xx-dv-a-x-x-tr-mkt.pdf?src-supplier=Digi-Key; ComponentLink6Description: http://suddendocs.samtec.com/prints/lshm-1xx-xx.x-xx-dv-a-x-x-tr-mkt.pdf?src-supplier=Digi-Key; ComponentLink7URL: ftp://ftp.samtec.com/webfiles/PDF/LSHM.PDF?src-supplier=Avnet; ComponentLink7Description: ftp://ftp.samtec.com/webfiles/PDF/LSHM.PDF?src-supplier=Avnet; ComponentLink8URL: ftp://ftp.samtec.com/webfiles/PDF/LSHM.PDF?src-supplier=Avnet+Europe; ComponentLink8Description: ftp://ftp.samtec.com/webfiles/PDF/LSHM.PDF?src-supplier=Avnet+Europe; ComponentLink9URL: http://www.farnell.com/datasheets/2372721.pdf?src-supplier=Newark; ComponentLink9Description: http://www.farnell.com/datasheets/2372721.pdf?src-supplier=Newark; Supplier Part Number 1: SAM13196CT-ND; Manufacturer Part Number: LSHM-120-02.5-L-DV-A-N-K-TR
R30 = CMP-2000-04142-1: Manufacturer: Yageo; Part Number: RC0603FR-07806RL
R31 = CMP-2000-03938-1: Manufacturer: Yageo; Part Number: RC0603FR-071K82L
R32 = CMP-2002-01683-2: RES 10K OHM 0.1% 1/10W 0402; Manufacturer: Vishay; Power Rating: 0.1W; Temperature Coefficient: 25ppm/°C; Automotive Grade: Grade 0; Voltage Rating: 50V; Resistance: 10kΩ; Automotive: Yes; Digikey Description: RES 10K OHM 0.1% 1/10W 0402; Device Class L2: Resistors; Manufacturer Part Number: TNPW040210K0BEED; Temperature: -55°C to +155°C; ComponentLink2Description: Datasheet; Ipc Land Pattern Name: RESC10050X35; Temperature Range High: +155°C; Composition: Thin Film; Tolerance: 0.1%; Device Class L3: Chip SMD Resistors; Package: TNPW0402-e3; Octopart: https://octopart.com/tnpw040210k0beed-vishay-41229038; Device Class L1: Passive Components; Series: TNPW; Value: 10k; Temperature Range Low: -55°C; Height: 0.4mm; Category: Res; Lead Free: Yes; RoHS: TRUE; ComponentLink2URL: http://www.vishay.com/docs/28758/tnpw_e3.pdf
R33 R34 = CMP-1011-00001-2: Manufacturer: Yageo / Phycomp; Part Number: RC0402JR-070RL
R35 = CMP-2002-05495-2: Thick Film Chip Resistors 0402 0Ω 0.0625W 5%; Voltage Rating (DC): 50V; Max Power Dissipation: 63mW; Temperature Coefficient: 500ppm/°C; Power Rating: 62.5mW; Depth: 0.5mm; Packaging: Tape and Reel; REACH SVHC: No SVHC; Max Operating Temperature: 125°C; Case Code (Metric): 1005; Case Code (Imperial): 0402; Case/Package: 0402; Number of Pins: 2; Thickness: 356um; Composition: Thick Film; Voltage Rating: 50V; Min Operating Temperature: -55°C; Tolerance: 5%; Radiation Hardening: No; Height: 0.35mm; Termination: SMD/SMT; Width: 0.5mm; Mount: Surface Mount; Package Quantity: 10000; Contact Plating: Tin; Length: 1mm
R36 = CMP-03412-013083-1: RES SMD 24.9K OHM 1% 1/10W 0603; Manufacturer: Yageo; Approved Alternate Part Number: 541-1.00HHCT-ND; Voltage Rating: 75V; Power Rating: 0.1W; Value: 24.9kΩ; Power: 100mW; Temperature Coefficient: 100ppm/°C; Footprint Url: https://www.yageo.com/upload/website/yageo_PYu-R_Mount_10_19050818_343.pdf; Automotive: No; Temperature Range Low: -55°C; Manufacturer Part Number: RC0603FR-0724K9L; Ipc Land Pattern Name: RESC16080X45; Digikey Description: RES SMD 24.9K OHM 1% 1/10W 0603; Voltage: 75V; Composition: Thick Film; Device Class L1: Passive Components; Device Class L2: Resistors; Device Class L3: Chip SMD Resistors; ComponentLink2URL: https://www.yageo.com/upload/media/product/productsearch/datasheet/rchip/PYu-RC_Group_51_RoHS_L_10.pdf; Series: RC_L; Octopart: https://octopart.com/rc0603fr-0724k9l-yageo-1189838; RoHS: TRUE; Category: Res; Height: 0.55mm; Tolerance: 1%; Temperature: -55°C to +155°C; Temperature Range High: +155°C; ComponentLink2Description: Datasheet; Package: RC_L0603; Lead Free: Yes; Mouser Description: Res Thick Film 1.6 x 0.8 mm 24.9K Ohm 1% 0.1W(1/10W) 100ppm/ C Molded SMD Paper T/R
R37 R38 = CMP-2000-00320-1: Manufacturer: YAEGO; Part Number: RC0603FR-072ML
U6 = XC8102AA01MR-G: No Description Available; Mfr_Name: Torex Semiconductor; Copyright: Copyright (C) 2021 Ultra Librarian. All rights reserved.; Manufacturer_Part_Number: XC8102AA01MR-G; RefDes: RefDes; Type: DEV
U7 = CMP-0018-00480-2: Very Low Power, Rail to Rail Out, Negative Rail In, VFB Operational Amplifier, 2.5 to 5.5 V, -40 to 125 degC, 6-pin SOT23 (DBV6), Green (RoHS & no Sb/Br); Manufacturer: Texas Instruments; Iq per channel(Max)(mA): 1; Settling Time (0.1%)(Typ)(ns): 30; Vs(Min)(V): 2.5; Vio(Max)(mV): 0.4; 3rd Harmonic(dBc): 105; BW @ Acl(MHz): 205; Vs(Max)(V): 5.5; 2nd Harmonic(dBc): 85; Sub Family: Audio Operational Amplifier, High Output Current Amplifier (>=50mA), High Speed Amplifier (>=50MHz), Low Noise Amp (<=10nV/rtHz), Low Offset Voltage Amplifier (<=500uV), Low Supply Voltage Amplifier (<=2.7V); Vn at Flatband(Typ)(nV/rtHz): 4.6; Iib(Max)(nA): 1000; Slew Rate(Typ)(V/us): 560; Io(Typ)(mA): 50; Number of Channels: 1; Eco-Plan: Green (RoHS & no Sb/Br); PartNumber: OPA836IDBVT; ComponentLink3URL: http://www.ti.com/litv/pdf/mpds026h; ComponentLink3Description: Package Specification; @ MHz: 1; ComponentLink1Description: Manufacturer URL; ComponentLink2URL: http://www.ti.com/general/docs/lit/getliterature.tsp?genericPartNumber=OPA836&fileType=pdf; Acl, min stable gain(V/V): 1; PackageVersion: 4073253-5/K, 03/2006; PackageDescription: 6-Pin Plastic Small Outline, Body 1.6 x 2.9 mm, Pitch 0.95 mm; ComponentLink1URL: http://www.ti.com/; ComponentLink2Description: Datasheet; PackageReference: DBV0006A; Code_JEDEC: MO-178; DatasheetVersion: SLOS712D; Mounting Technology: Surface Mount

## Sheet 04_MR_WOLF.SchDoc: Wearable Ultra Low-Power Ultrasound probe
size A3; DrawnBy: Sebastian Frey; Organization: Integrated Systems Laboratory; Revision: v1.0; SheetNumber: 5; SheetTotal: 6
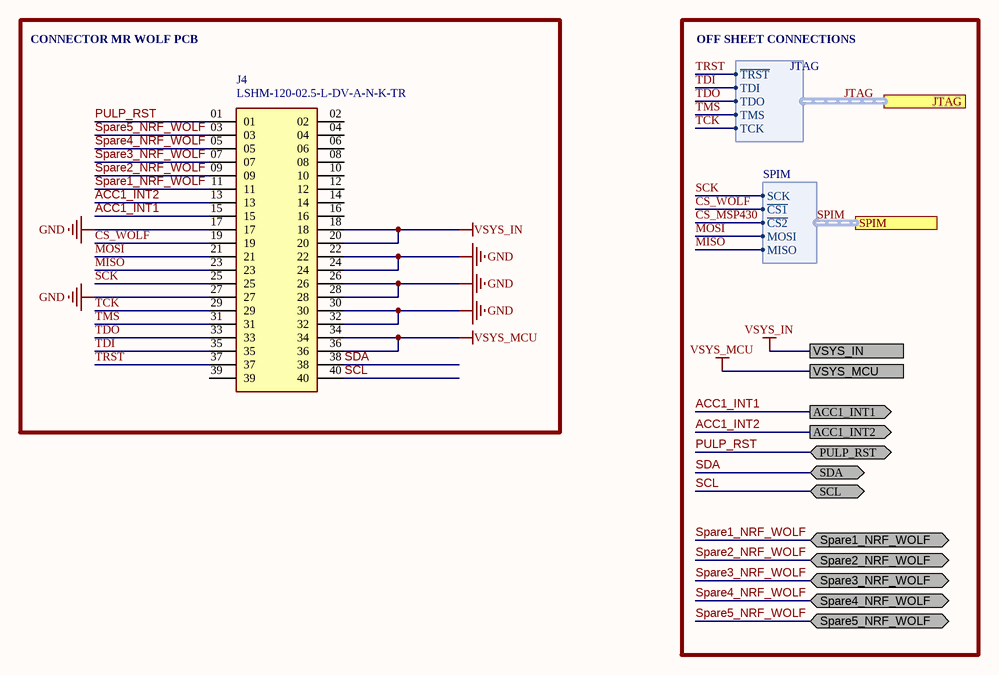
[diagram p4: 04_MR_WOLF.SchDoc]

### Parts
J4  LSHM-120-02.5-L-DV-A-N-K-TR  [SAMTEC_LSHM-120-XX.X-X-DV-A-N-XX]

### Blocks framed on the sheet
CONNECTOR MR WOLF PCB: J4

### Ports
ACC1_INT1 (out), ACC1_INT2 (out), JTAG (harness JTAG), PULP_RST (bidir), SCL (bidir), SDA (bidir), Spare1_NRF_WOLF (bidir), Spare2_NRF_WOLF (bidir), Spare3_NRF_WOLF (bidir), Spare4_NRF_WOLF (bidir), Spare5_NRF_WOLF (bidir), SPIM (harness SPIM), VSYS_IN, VSYS_MCU

### Harnesses
JTAG: ~{TRST}, TCK, TMS, TDI, TDO
SPIM: SCK, ~{CS1}, ~{CS2}, MOSI, MISO

### Nets
GND: J4.17 J4.22 J4.24 J4.26 J4.27 J4.28 J4.30 J4.32
VSYS_IN: J4.18 J4.20 ; port VSYS_IN
VSYS_MCU: J4.34 J4.36 ; port VSYS_MCU
ACC1_INT1: J4.15 ; port ACC1_INT1
ACC1_INT2: J4.13 ; port ACC1_INT2
CS_WOLF: J4.19 ; port SPIM.~{CS1}
MISO: J4.23 ; port SPIM.MISO
MOSI: J4.21 ; port SPIM.MOSI
PULP_RST: J4.01 ; port PULP_RST
SCK: J4.25 ; port SPIM.SCK
SCL: J4.40 ; port SCL
SDA: J4.38 ; port SDA
Spare1_NRF_WOLF: J4.11 ; port Spare1_NRF_WOLF
Spare2_NRF_WOLF: J4.09 ; port Spare2_NRF_WOLF
Spare3_NRF_WOLF: J4.07 ; port Spare3_NRF_WOLF
Spare4_NRF_WOLF: J4.05 ; port Spare4_NRF_WOLF
Spare5_NRF_WOLF: J4.03 ; port Spare5_NRF_WOLF
TCK: J4.29 ; port JTAG.TCK  [project net JTAG.TCK]
TDI: J4.35 ; port JTAG.TDI  [project net JTAG.TDI]
TDO: J4.33 ; port JTAG.TDO  [project net JTAG.TDO]
TMS: J4.31 ; port JTAG.TMS  [project net JTAG.TMS]
TRST: J4.37 ; port JTAG.~{TRST}  [project net JTAG.~{TRST}]

Not connected (* = marked no-connect by the designer): J4 02 04 06 08 10 12 14 16 39

### Buses and harness runs
harness JTAG = port JTAG
harness SPIM = port SPIM

### Notes on the sheet
- OFF SHEET CONNECTIONS
- 1
- 2
- 3
- 4
- 5
- 6
- 7
- 8
- A
- B
- C
- D
- Project:
- Date:
- Drawing number:
- Rev:
- Format:
- A3
- Drawn by:
- Laboratory:
- Page
- Sheet:
- of
- File:

### Library data of the parts
J4 = LSHM-120-02.5-L-DV-A-N-K-TR: as J3 on sheet 03_MSP430_AFE; Supplier 1: Digi-Key; RoHS: Yes; Category: Connectors; Stock 1: 3008; Pricing 1: 1=6.60000, 10=5.97000, 25=5.63960, 50=5.50200, 100=5.22690, 250=4.67672 (USD); Contact Plating: Gold; Contact Material: Bronze; Housing Color: Black; Housing Material: Polymer; Min Operating Temperature: -55°C; Max Operating Temperature: 125°C; Number of Rows: 2; Termination: Solder; Packaging: Tape and Reel; Orientation: Straight; Series: LSH; Length: 14.7mm; Pitch: 0.5mm; Depth: 4.98mm; Radiation Hardening: No; REACH SVHC: No SVHC; RoHS Compliant: Yes; ComponentLink1URL: http://www.farnell.com/datasheets/2372721.pdf?src-supplier=Farnell; ComponentLink1Description: http://www.farnell.com/datasheets/2372721.pdf?src-supplier=Farnell; ComponentLink2URL: http://www.farnell.com/datasheets/2000266.pdf?src-supplier=Farnell; ComponentLink2Description: http://www.farnell.com/datasheets/2000266.pdf?src-supplier=Farnell; ComponentLink3URL: http://components.arrow.com/part/dataview/0323_01943898?src-supplier=Arrow+Europe; ComponentLink3Description: http://components.arrow.com/part/dataview/0323_01943898?src-supplier=Arrow+Europe; ComponentLink4URL: http://components.arrow.com/part/dataview/48680868S8397842N1004?src-supplier=Arrow+Electronics; ComponentLink4Description: http://components.arrow.com/part/dataview/48680868S8397842N1004?src-supplier=Arrow+Electronics; ComponentLink5URL: http://www.farnell.com/datasheets/2000266.pdf?src-supplier=Element14; ComponentLink5Description: http://www.farnell.com/datasheets/2000266.pdf?src-supplier=Element14; ComponentLink6URL: http://suddendocs.samtec.com/prints/lshm-1xx-xx.x-xx-dv-a-x-x-tr-mkt.pdf?src-supplier=Digi-Key; ComponentLink6Description: http://suddendocs.samtec.com/prints/lshm-1xx-xx.x-xx-dv-a-x-x-tr-mkt.pdf?src-supplier=Digi-Key; ComponentLink7URL: ftp://ftp.samtec.com/webfiles/PDF/LSHM.PDF?src-supplier=Avnet; ComponentLink7Description: ftp://ftp.samtec.com/webfiles/PDF/LSHM.PDF?src-supplier=Avnet; ComponentLink8URL: ftp://ftp.samtec.com/webfiles/PDF/LSHM.PDF?src-supplier=Avnet+Europe; ComponentLink8Description: ftp://ftp.samtec.com/webfiles/PDF/LSHM.PDF?src-supplier=Avnet+Europe; ComponentLink9URL: http://www.farnell.com/datasheets/2372721.pdf?src-supplier=Newark; ComponentLink9Description: http://www.farnell.com/datasheets/2372721.pdf?src-supplier=Newark; Supplier Part Number 1: SAM13196CT-ND; Manufacturer Part Number: LSHM-120-02.5-L-DV-A-N-K-TR

## Sheet 05_IMU.SchDoc: Wearable Ultra Low-Power Ultrasound probe
size A3; DrawnBy: Sebastian Frey; Organization: Integrated Systems Laboratory; Revision: v1.0; SheetNumber: 6; SheetTotal: 6
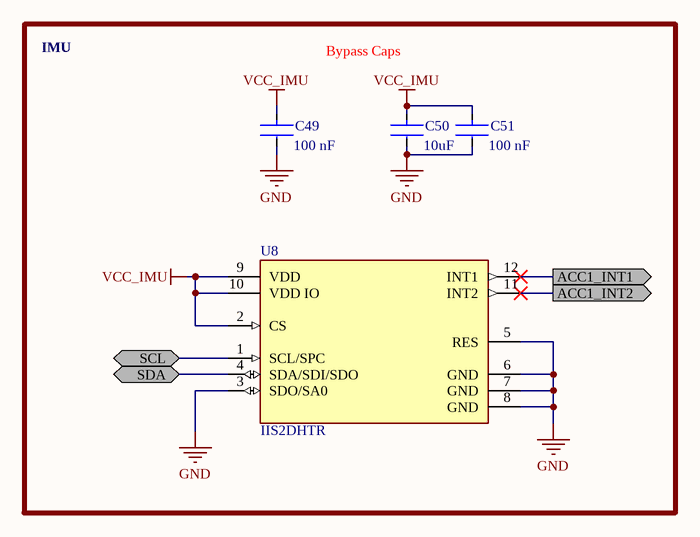
[diagram p5: 05_IMU.SchDoc]

### Parts
C49  value 100 nF  [FP-CC0402-MFG]  (hidden comment: CC0402KRX7R7BB104)
C50  value 10uF  [FP-C1608-080-MFG]  (hidden comment: C1608X5R1A106K080AC)
C51  value 100 nF  [FP-CC0402-MFG]  (hidden comment: CC0402KRX7R7BB104)
U8  IIS2DHTR  [FP-LGA-12-8365767-MFG]

### Blocks framed on the sheet
IMU: C49-C51 U8

### Ports
ACC1_INT1 (out), ACC1_INT2 (out), SCL (bidir), SDA (bidir)

### Nets
GND: C49.2 C50.2 C51.2 U8.3(SDO/SA0) U8.5(RES) U8.6(GND) U8.7(GND) U8.8(GND)
VCC_IMU: C49.1 C50.1 C51.1 U8.2(CS) U8.9(VDD) U8.10(VDD_IO)
ACC1_INT1: U8.12(INT1) ; port ACC1_INT1
ACC1_INT2: U8.11(INT2) ; port ACC1_INT2
SCL: U8.1(SCL/SPC) ; port SCL
SDA: U8.4(SDA/SDI/SDO) ; port SDA

### Notes on the sheet
- Bypass Caps
- 1
- 2
- 3
- 4
- 5
- 6
- 7
- 8
- A
- B
- C
- D
- Project:
- Date:
- Drawing number:
- Rev:
- Format:
- A3
- Drawn by:
- Laboratory:
- Page
- Sheet:
- of
- File:

### Library data of the parts
C49 C51 = CMP-03422-000048-1: as C27 on sheet 02_MSP430; Device Class L1: Passive Components; Temperature Range Low: -55°C; Device Class L3: Ceramic Capacitors; Temperature Characteristic: X7R; Ipc Land Pattern Name: CAPC10050X50; Capacitance: 100 nF; Temperature Range High: +125°C; Voltage Rating: 16 V; Temperature: -55°C to +125°C; RoHS: TRUE; Automotive: No; Height: 0.55mm; Device Class L2: Capacitors; Digikey Description: CAP CER 0.1UF 16V X7R 0402; Package: CC0402; Footprint Url: http://www.yageo.com/exep/pages/download/literatures/UPY-C_GEN_24.pdf; ComponentLink2Description: Datasheet; Category: Cap; Lead Free: Yes; Octopart: https://octopart.com/cc0402krx7r7bb104-yageo-42244624; ComponentLink2URL: http://www.yageo.com/documents/recent/UPY-GP_NP0_16V-to-50V_16.pdf; Manufacturer Part Number: CC0402KRX7R7BB104; Mouser Description: 0402 0.1 uF 16 V ±10 % Tolerance X7R SMT Multilayer Ceramic Capacitor
C50 = CMP-2000-04979-2: CAP CER 10UF 10V X5R 0603; Manufacturer: TDK; Temperature Coefficient: 15%; Tolerance: 10%; Material: Ceramic; Mouser Description: CAP CER 10UF 10V X5R 0603; Package: C1608-080; Lead Free: Yes; Device Class L1: Passive Components; Temperature Range High: +85°C; Manufacturer Part Number: C1608X5R1A106K080AC; Octopart: https://octopart.com/c1608x5r1a106k080ac-tdk-26013468; Voltage: 10V; Footprint Url: https://product.tdk.com/info/en/catalog/spec/mlccspec_commercial_general_midvoltage_en.pdf; Ipc Land Pattern Name: CAPC16080X80; Temperature Range Low: -55°C; Temperature: -55°C to +85°C; ComponentLink2Description: Datasheet; ComponentLink2URL: https://product.tdk.com/info/en/documents/chara_sheet/C1608X5R1A106K080AC.pdf; Height: 0.9mm; Temperature Characteristic: X5R; RoHS: TRUE; Category: Cap; Capacitance: 10uF; Digikey Description: CAP CER 10UF 10V X5R 0603; Automotive: No; Device Class L3: Ceramic Capacitors; Device Class L2: Capacitors; Voltage Rating: 10V
U8 = CMP-12175-000008-1: ACCEL 2-16G I2C/SPI 12LGA; Manufacturer: STMicroelectronics; Operating Supply Current: 2-11uA; Max Supply Voltage: 3.7V; Accel Axis: X+Y and Z; Sensor Output: I2C,SPI; Min Supply Voltage: 1.71V; Accel Range: 2/4/8/16g; Height: 1mm; Device Class L1: Sensors; Manufacturer Part Number: IIS2DHTR; Temperature Range High: +85°C; ComponentLink2Description: Datasheet; Automotive: No; Temperature Range Low: -40°C; Package: LGA-12-8365767; Octopart: https://octopart.com/iis2dhtr-stmicroelectronics-58218805; Digikey Description: ACCEL 2-16G I2C/SPI 12LGA; ComponentLink2URL: https://www.st.com/content/ccc/resource/technical/document/datasheet/group1/35/6d/04/26/27/5c/4d/7c/DM00171283/files/DM00171283.pdf/jcr:content/translations/en.DM00171283.pdf; Temperature: -40°C to +85°C; Category: IC; RoHS: TRUE; Device Class L3: Accelerometers; Lead Free: Yes; Device Class L2: Motion Sensors

## Nets that join several sheets
GND: 00_POWER (19 pins), 01_NRF52 (24 pins), 02_MSP430 (18 pins), 03_MSP430_AFE (J3.05 J3.07 J3.12 J3.24), 04_MR_WOLF (8 pins), 05_IMU (8 pins)
USS_GND: 00_POWER (8 pins), 02_MSP430 (17 pins), 03_MSP430_AFE (17 pins)
VCC_AFE: 00_POWER (R8.2 TP14.1), 01_NRF52 (J5.6), 03_MSP430_AFE (J3.29 J3.30 J3.31 J3.32)
VCC_IMU: 00_POWER (R13.2 TP22.1), 05_IMU (6 pins)
VCC_MSP430: 00_POWER (R11.2 TP20.1), 02_MSP430 (6 pins), 03_MSP430_AFE (C39.2 U6.1)
VCC_NRF52: 00_POWER (R10.2 TP18.1), 01_NRF52 (7 pins)
VSYS_IN: 00_POWER (5 pins), 04_MR_WOLF (J4.18 J4.20)
VSYS_MCU: 00_POWER (10 pins), 03_MSP430_AFE (J3.01 J3.03), 04_MR_WOLF (J4.34 J4.36)
ACC1_INT1: 01_NRF52 (U4.15), 04_MR_WOLF (J4.15), 05_IMU (U8.12)
ACC1_INT2: 01_NRF52 (U4.16), 04_MR_WOLF (J4.13), 05_IMU (U8.11)
CH0_IN: 02_MSP430 (U5.60), 03_MSP430_AFE (C44.2 R33.1)
CH0_OUT: 02_MSP430 (R25.1 U5.59), 03_MSP430_AFE (J3.37)
CH1_IN: 02_MSP430 (U5.53), 03_MSP430_AFE (J3.38)
CH1_OUT: 02_MSP430 (R24.1 U5.54), 03_MSP430_AFE (J3.40)
CS_MSP430: 01_NRF52 (U4.9), 02_MSP430 (U5.22)
CS_WOLF: 01_NRF52 (U4.14), 04_MR_WOLF (J4.19)
DataReady: 01_NRF52 (U4.41), 02_MSP430 (U5.28)
EN_HV: 00_POWER (R2.1 U1.5), 02_MSP430 (U5.2)
ExtraConn_MSP_P5.0: 01_NRF52 (J5.3), 02_MSP430 (U5.34)
ExtraConn_MSP_P5.1: 01_NRF52 (J5.4), 02_MSP430 (U5.35)
JTAG.~{TRST}: 01_NRF52 (U4.4), 04_MR_WOLF (J4.37)
JTAG.TCK: 01_NRF52 (U4.8), 04_MR_WOLF (J4.29)
JTAG.TDI: 01_NRF52 (U4.5), 04_MR_WOLF (J4.35)
JTAG.TDO: 01_NRF52 (U4.6), 04_MR_WOLF (J4.33)
JTAG.TMS: 01_NRF52 (U4.7), 04_MR_WOLF (J4.31)
MISO: 01_NRF52 (U4.11), 02_MSP430 (TP9.1 U5.20), 04_MR_WOLF (J4.23)
MOSI: 01_NRF52 (U4.12), 02_MSP430 (TP8.1 U5.19), 04_MR_WOLF (J4.21)
PULP_RST: 01_NRF52 (R21.1 U4.22), 04_MR_WOLF (J4.01)
RxEn: 02_MSP430 (U5.42), 03_MSP430_AFE (R34.2)
RxPwr: 02_MSP430 (U5.23), 03_MSP430_AFE (U6.3)
SCK: 01_NRF52 (U4.10), 02_MSP430 (TP10.1 U5.21), 04_MR_WOLF (J4.25)
SCL: 00_POWER (R20.2 U3.2), 01_NRF52 (U4.43), 04_MR_WOLF (J4.40), 05_IMU (U8.1)
SDA: 00_POWER (R19.2 U3.1), 01_NRF52 (U4.42), 04_MR_WOLF (J4.38), 05_IMU (U8.4)
Spare1_MSP_AFE: 02_MSP430 (U5.43), 03_MSP430_AFE (J3.14)
Spare1_NRF_MSP: 01_NRF52 (U4.40), 02_MSP430 (U5.29)
Spare1_NRF_WOLF: 01_NRF52 (U4.17), 04_MR_WOLF (J4.11)
Spare2_MSP_AFE: 02_MSP430 (U5.44), 03_MSP430_AFE (J3.16)
Spare2_NRF_MSP: 01_NRF52 (U4.39), 02_MSP430 (U5.30)
Spare2_NRF_WOLF: 01_NRF52 (U4.18), 04_MR_WOLF (J4.09)
Spare3_MSP_AFE: 02_MSP430 (U5.45), 03_MSP430_AFE (J3.18)
Spare3_NRF_MSP: 01_NRF52 (U4.38), 02_MSP430 (U5.31)
Spare3_NRF_WOLF: 01_NRF52 (U4.19), 04_MR_WOLF (J4.07)
Spare4_MSP_AFE: 02_MSP430 (U5.47), 03_MSP430_AFE (J3.22)
Spare4_NRF_MSP: 01_NRF52 (U4.37), 02_MSP430 (U5.32)
Spare4_NRF_WOLF: 01_NRF52 (U4.20), 04_MR_WOLF (J4.05)
Spare5_NRF_WOLF: 01_NRF52 (U4.21), 04_MR_WOLF (J4.03)
Switch_CLK: 02_MSP430 (U5.38), 03_MSP430_AFE (J3.04)
Switch_CLR: 02_MSP430 (U5.37), 03_MSP430_AFE (J3.02)
Switch_D_IN: 02_MSP430 (U5.39), 03_MSP430_AFE (J3.06)
Switch_D_OUT: 02_MSP430 (U5.40), 03_MSP430_AFE (J3.08)
Switch_LE: 02_MSP430 (U5.41), 03_MSP430_AFE (J3.10)
TxPwr: 02_MSP430 (U5.46), 03_MSP430_AFE (J3.20)

## Assembly variants
Only fitted: all parts fitted